# Altium schematic sheet VFC.SchDoc
size A4; SheetNumber: 3; SheetTotal: 6
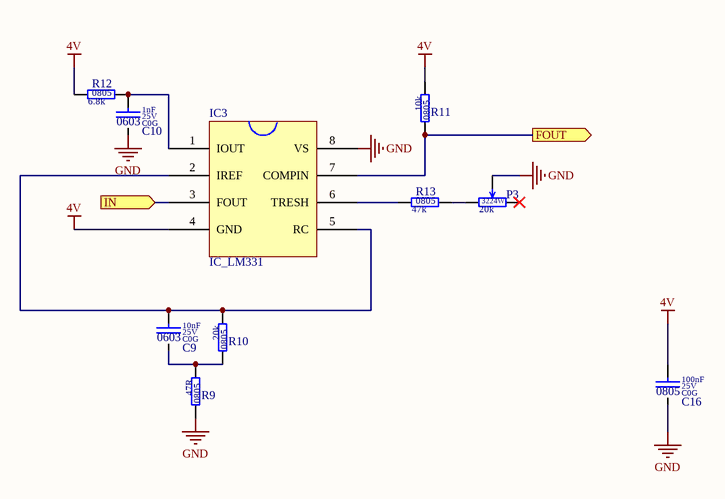
[diagram p0: VFC.SchDoc]

## Parts
C9  value 10nF  Dielectric: C0G  Voltage: 25V  SCH_Footprint: 0603  [C_0603_1608]  (hidden comment: C_10nF_0603_C0G_25V_5)
C10  value 1nF  Dielectric: C0G  Voltage: 25V  SCH_Footprint: 0603  [C_0603_1608]  (hidden comment: C_1nF_0603_C0G_25V_5)
C16  value 100nF  Dielectric: C0G  Voltage: 25V  SCH_Footprint: 0805  [C_0805_2012]  (hidden comment: C_100nF_0805_C0G_25V_5)
IC3  IC_LM331  [DIP8]
P3  value 20k  SCH_Footprint: 3224W  [Potentiometer]  (hidden comment: POT)
R9  SCH_Footprint: 0805  Resistance: 47R  [R_0805_2012]  (hidden comment: R_47R_0805_5)
R10  SCH_Footprint: 0805  Resistance: 20k  [R_0805_2012]  (hidden comment: R_22k_0805_5)
R11  SCH_Footprint: 0805  Resistance: 10k  [R_0805_2012]  (hidden comment: R_10k_0805_5)
R12  SCH_Footprint: 0805  Resistance: 6.8k  [R_0805_2012]  (hidden comment: R_6.8k_0805_5)
R13  SCH_Footprint: 0805  Resistance: 47k  [R_0805_2012]  (hidden comment: R_47k_0805_5)

## Ports
FOUT (out), IN (in)

## Nets
4V: C16.1 IC3.4(GND) R11.1 R12.1
GND: C10.2 C16.2 IC3.8(VS) P3.2 R9.2
FOUT: IC3.7(COMPIN) R11.2 ; port FOUT
IN: IC3.3(FOUT) ; port IN
NetC9_1: C9.1 IC3.2(IREF) IC3.5(RC) R10.1
NetC9_2: C9.2 R9.1 R10.2
NetC10_1: C10.1 IC3.1(IOUT) R12.2
NetIC3_6: IC3.6(TRESH) R13.1
NetP3_1: P3.1 R13.2

Not connected (* = marked no-connect by the designer): P3 3*

## Library data of the parts
C9 = C_10nF_0603_C0G_25V_5: Capacitor
C10 = C_1nF_0603_C0G_25V_5: Capacitor
C16 = C_100nF_0805_C0G_25V_5: Capacitor
R9 = R_47R_0805_5: Tolerance: 5
R10 = R_22k_0805_5: Tolerance: 5
R11 = R_10k_0805_5: Tolerance: 5
R12 = R_6.8k_0805_5: Tolerance: 5
R13 = R_47k_0805_5: Tolerance: 5